# Altium project I2C_IMU_BAROMETER.PrjPcb
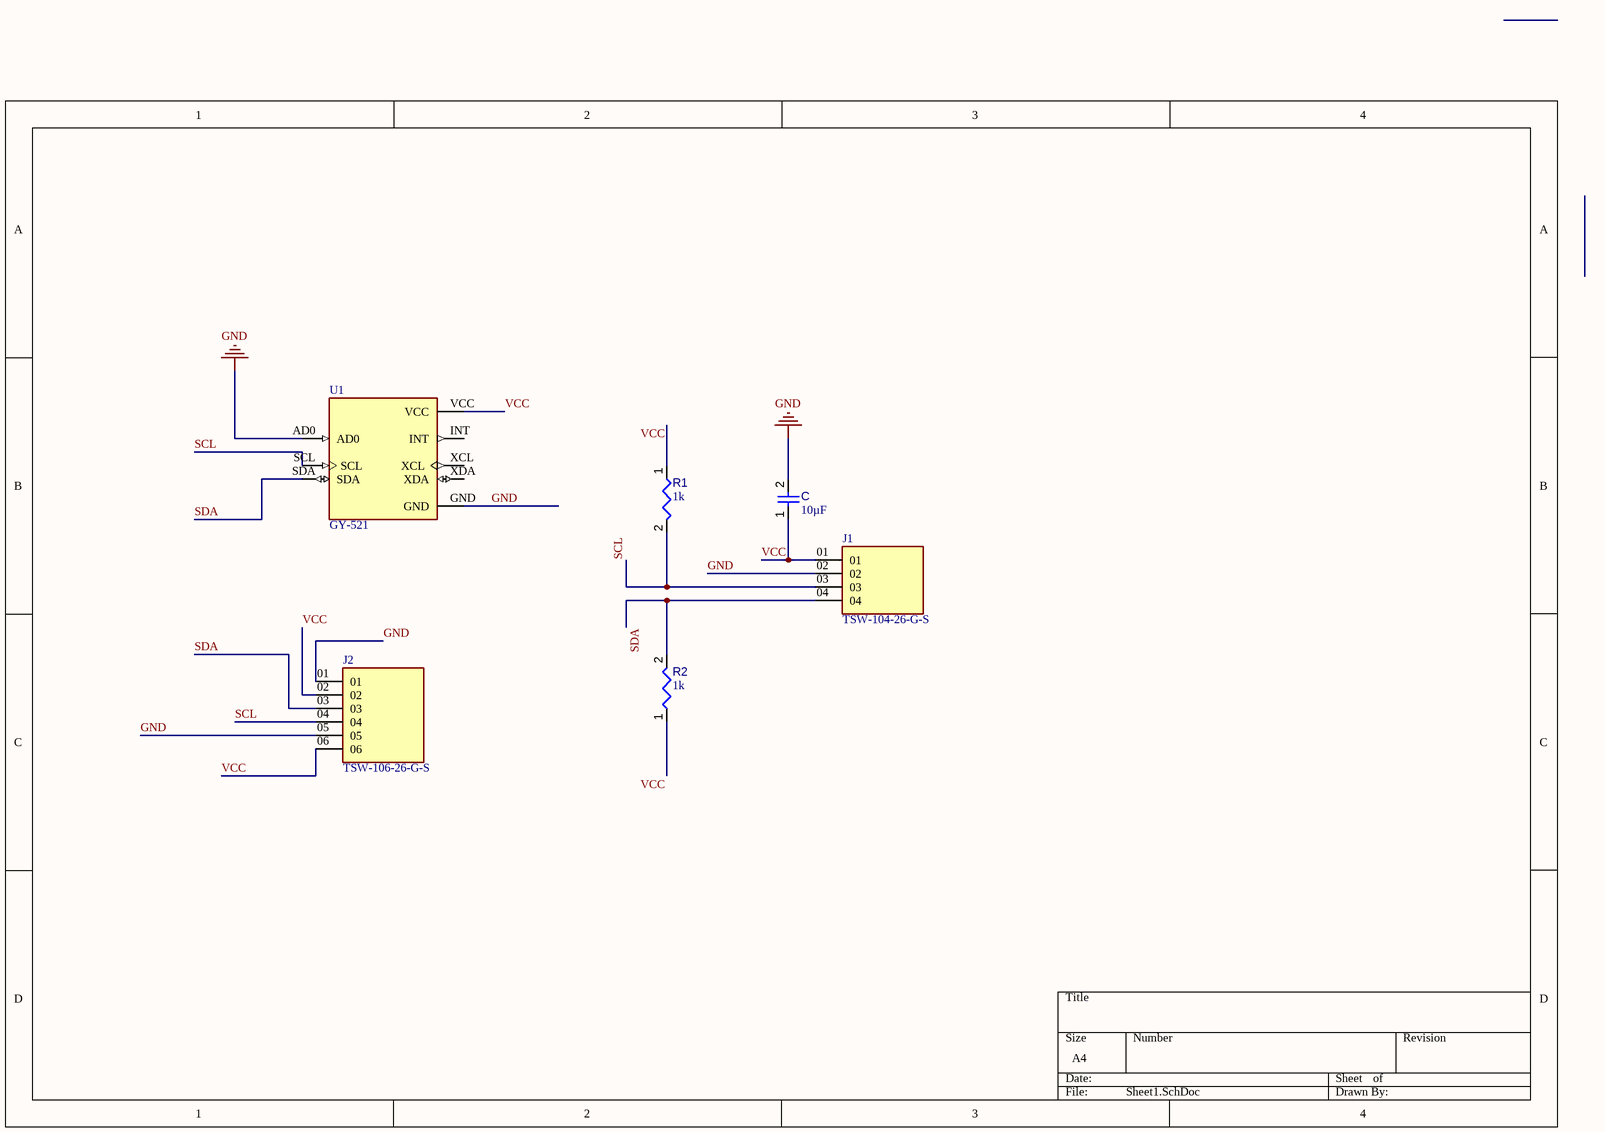
[diagram p0: Sheet1.SchDoc]
1 sheet, 6 parts. Net scope: global (net labels, ports and power ports of the same name join across sheets).
Board file: PCB1.PcbDoc

## Sheet Sheet1.SchDoc
size A4; SheetNumber: 1; SheetTotal: 1

### Parts
C  value 10µF  [CAPC3216X180X50NL20T25]  (hidden comment: Capacitor 10 uF +/- 10% 16 V 1206)
J1  TSW-104-26-G-S  [SAMTEC_TSW-104-26-G-S]
J2  TSW-106-26-G-S  [SAMTEC_TSW-106-26-G-S]
R1  value 1k  [RESC0402(1005)_L]  (hidden comment: 1KR2J)
R2  value 1k  [RESC0402(1005)_L]  (hidden comment: 1KR2J)
U1  GY-521  [MODULE_GY-521]

### Nets
GND: C.2 J1.02 J2.01 J2.05 U1.AD0 U1.GND
SCL: J1.03 J2.04 R1.2 U1.SCL
SDA: J1.04 J2.03 R2.2 U1.SDA
VCC: C.1 J1.01 J2.02 J2.06 R1.1 R2.1 U1.VCC

Not connected (* = marked no-connect by the designer): U1 INT XCL XDA

### Library data of the parts
C = CMP-001-00016-6: Chip Capacitor, 10 uF, +/- 10%, 16 V, 1206 (3216 Metric); Capacitor Type: Ceramic; Voltage Rating: 16V; Tolerance: 10%; Min Operating Temperature: -55°C; Pins: 2; Mounting Technology: SM; Case/Package: 1206; Max Operating Temperature: 125°C; RoHS Compliant: True
J1 = CMP-009-000000-1: Price: None; Component Type: Standard; Package: None; Source: TSW-104-26-G-S.SchLib; Availability: Unavailable; Design Item ID: TSW-104-26-G-S; Pin Count: 4; Value: *; MP: TSW-104-26-G-S
J2 = CMP-007-000000-1: Design Item ID: TSW-106-26-G-S; Price: None; Availability: Unavailable; MP: TSW-106-26-G-S; Pin Count: 6; Component Type: Standard; Source: TSW-106-26-G-S.SchLib; Value: *; Package: None
R1 R2 = CMP-009-00075-2: 1K 0.063W 5% 0402 (1005 Metric)  SMD; Power: 63mW; Pins: 2; Mounting Technology: SMT; Case/Package: 0402; Tolerance: 5%
U1 = CMP-005-000000-1: Triple Axis Accelerometer Gyro Breakout; MF: GODREAM FORDREAM CO., LIMITED; MP: GY-521; SnapEDA_Link: https://www.snapeda.com/parts/GY-521/GODREAM+FORDREAM+CO.%252C+LIMITED/view-part/?ref=snap; Design Item ID: GY-521; Check_prices: https://www.snapeda.com/parts/GY-521/GODREAM+FORDREAM+CO.%252C+LIMITED/view-part/?ref=eda; Pin Count: 8; Value: *; Component Type: Standard; Package: Package; Source: GY-521.SchLib